# Altium schematic sheet Main.SchDoc
size A3; Organization: Altium Limited; Address1: L3, 12a Rodborough Rd; Address2: Frenchs Forest; Address3: NSW; Address4: Australia 2086
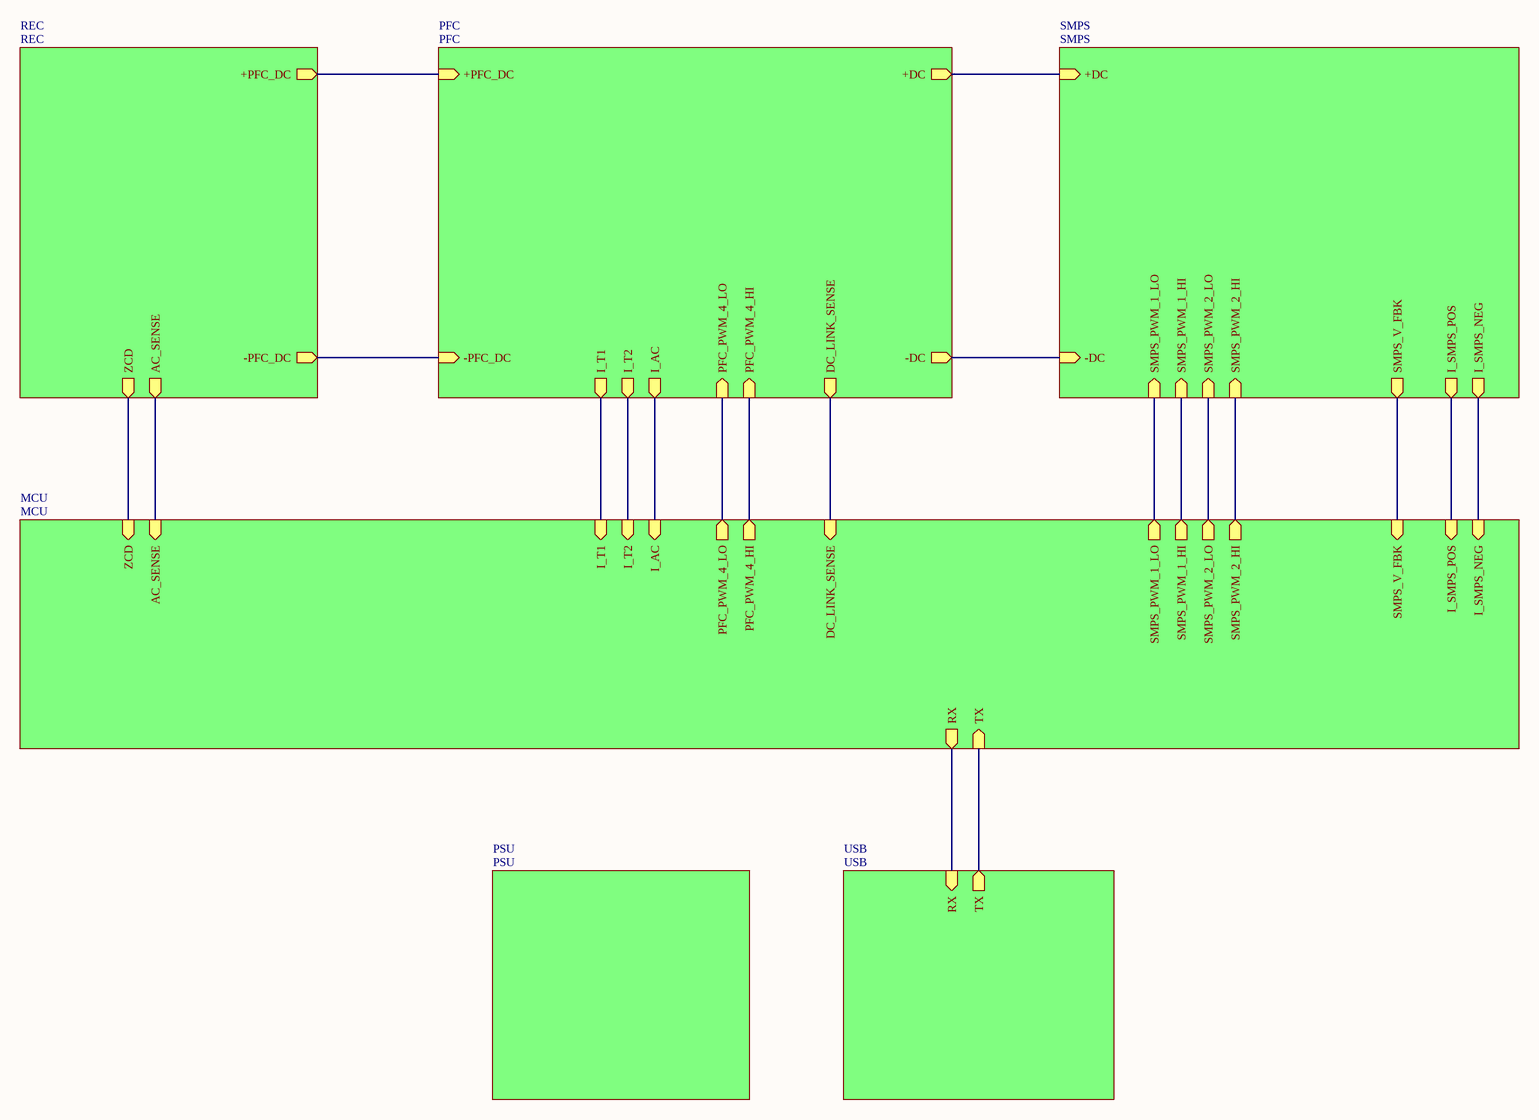
[diagram p0: Main.SchDoc]

## Sub-sheets
MCU = MCU: RX (out), TX (in), I_T1 (in), I_T2 (in), I_AC (in), PFC_PWM_4_LO (out), PFC_PWM_4_HI (out), DC_LINK_SENSE (in), SMPS_PWM_2_LO (out), SMPS_PWM_2_HI (out), AC_SENSE (in), ZCD (in), SMPS_V_FBK (in), SMPS_PWM_1_LO (out), SMPS_PWM_1_HI (out), I_SMPS_POS (in), I_SMPS_NEG (in)
PFC = PFC: +PFC_DC (in), -PFC_DC (in), +DC (out), -DC (out), I_T1 (out), I_T2 (out), I_AC (out), PFC_PWM_4_LO (in), PFC_PWM_4_HI (in), DC_LINK_SENSE (out)
PSU = PSU: no entries
REC = REC: +PFC_DC (out), -PFC_DC (out), AC_SENSE (out), ZCD (out)
SMPS = SMPS: +DC (in), -DC (in), SMPS_PWM_2_LO (in), SMPS_PWM_2_HI (in), SMPS_V_FBK (out), SMPS_PWM_1_HI (in), SMPS_PWM_1_LO (in), I_SMPS_POS (out), I_SMPS_NEG (out)
USB = USB: RX (in), TX (out)

## Nets
(unnamed): sheet REC/+PFC_DC, sheet PFC/+PFC_DC
(unnamed): sheet REC/-PFC_DC, sheet PFC/-PFC_DC
(unnamed): sheet REC/AC_SENSE, sheet MCU/AC_SENSE
(unnamed): sheet REC/ZCD, sheet MCU/ZCD
(unnamed): sheet PFC/+DC, sheet SMPS/+DC
(unnamed): sheet PFC/-DC, sheet SMPS/-DC
(unnamed): sheet PFC/I_T1, sheet MCU/I_T1
(unnamed): sheet PFC/I_T2, sheet MCU/I_T2
(unnamed): sheet PFC/I_AC, sheet MCU/I_AC
(unnamed): sheet PFC/PFC_PWM_4_LO, sheet MCU/PFC_PWM_4_LO
(unnamed): sheet PFC/PFC_PWM_4_HI, sheet MCU/PFC_PWM_4_HI
(unnamed): sheet PFC/DC_LINK_SENSE, sheet MCU/DC_LINK_SENSE
(unnamed): sheet SMPS/SMPS_PWM_2_LO, sheet MCU/SMPS_PWM_2_LO
(unnamed): sheet SMPS/SMPS_PWM_2_HI, sheet MCU/SMPS_PWM_2_HI
(unnamed): sheet SMPS/SMPS_V_FBK, sheet MCU/SMPS_V_FBK
(unnamed): sheet SMPS/SMPS_PWM_1_HI, sheet MCU/SMPS_PWM_1_HI
(unnamed): sheet SMPS/SMPS_PWM_1_LO, sheet MCU/SMPS_PWM_1_LO
(unnamed): sheet SMPS/I_SMPS_POS, sheet MCU/I_SMPS_POS
(unnamed): sheet SMPS/I_SMPS_NEG, sheet MCU/I_SMPS_NEG
(unnamed): sheet USB/RX, sheet MCU/RX
(unnamed): sheet USB/TX, sheet MCU/TX

## Notes on the sheet
- Title
- Size:
- Date:
- A3
- Number:
- Time:
- Revision:
- Sheet
- of
- File: